# Altium schematic sheet ПЛАКАТ_A2.SchDoc: Наименование
size 594 x 420 mm; ApprovedBy: Утвердил; CheckedBy: Проверил; Author: Разработал; CompanyName: Организация; SheetNumber: 1; SheetTotal: 1; PageSetup: Record=PageOptions|CenterHorizontal=True|CenterVertical=True|PrintScale=0.98|XCorrection=1.00|YCorrection=1.00|PrintKind=1|BorderSize=5000000|LeftOffset=0|BottomOffset=0|Orientation=2|PaperLength=1000|PaperWidth=1000|Scale=100|PaperSource=7|PrintQuality=-3|MediaType=1|DitherType=10|PrintScaleMode=1|PaperKind=A2|PaperIndex=66; DecimalNumber: Децимальный номер; HeadOfSector: Нач. сектора; MainDevice: Перв.примен.; Name1: Наименование1; lit_A: О; n_kontr: Н. Контр; t_kontr: Т. Контр; Name2: Наименование2; DocumentName: Sheet1.SCHDOC
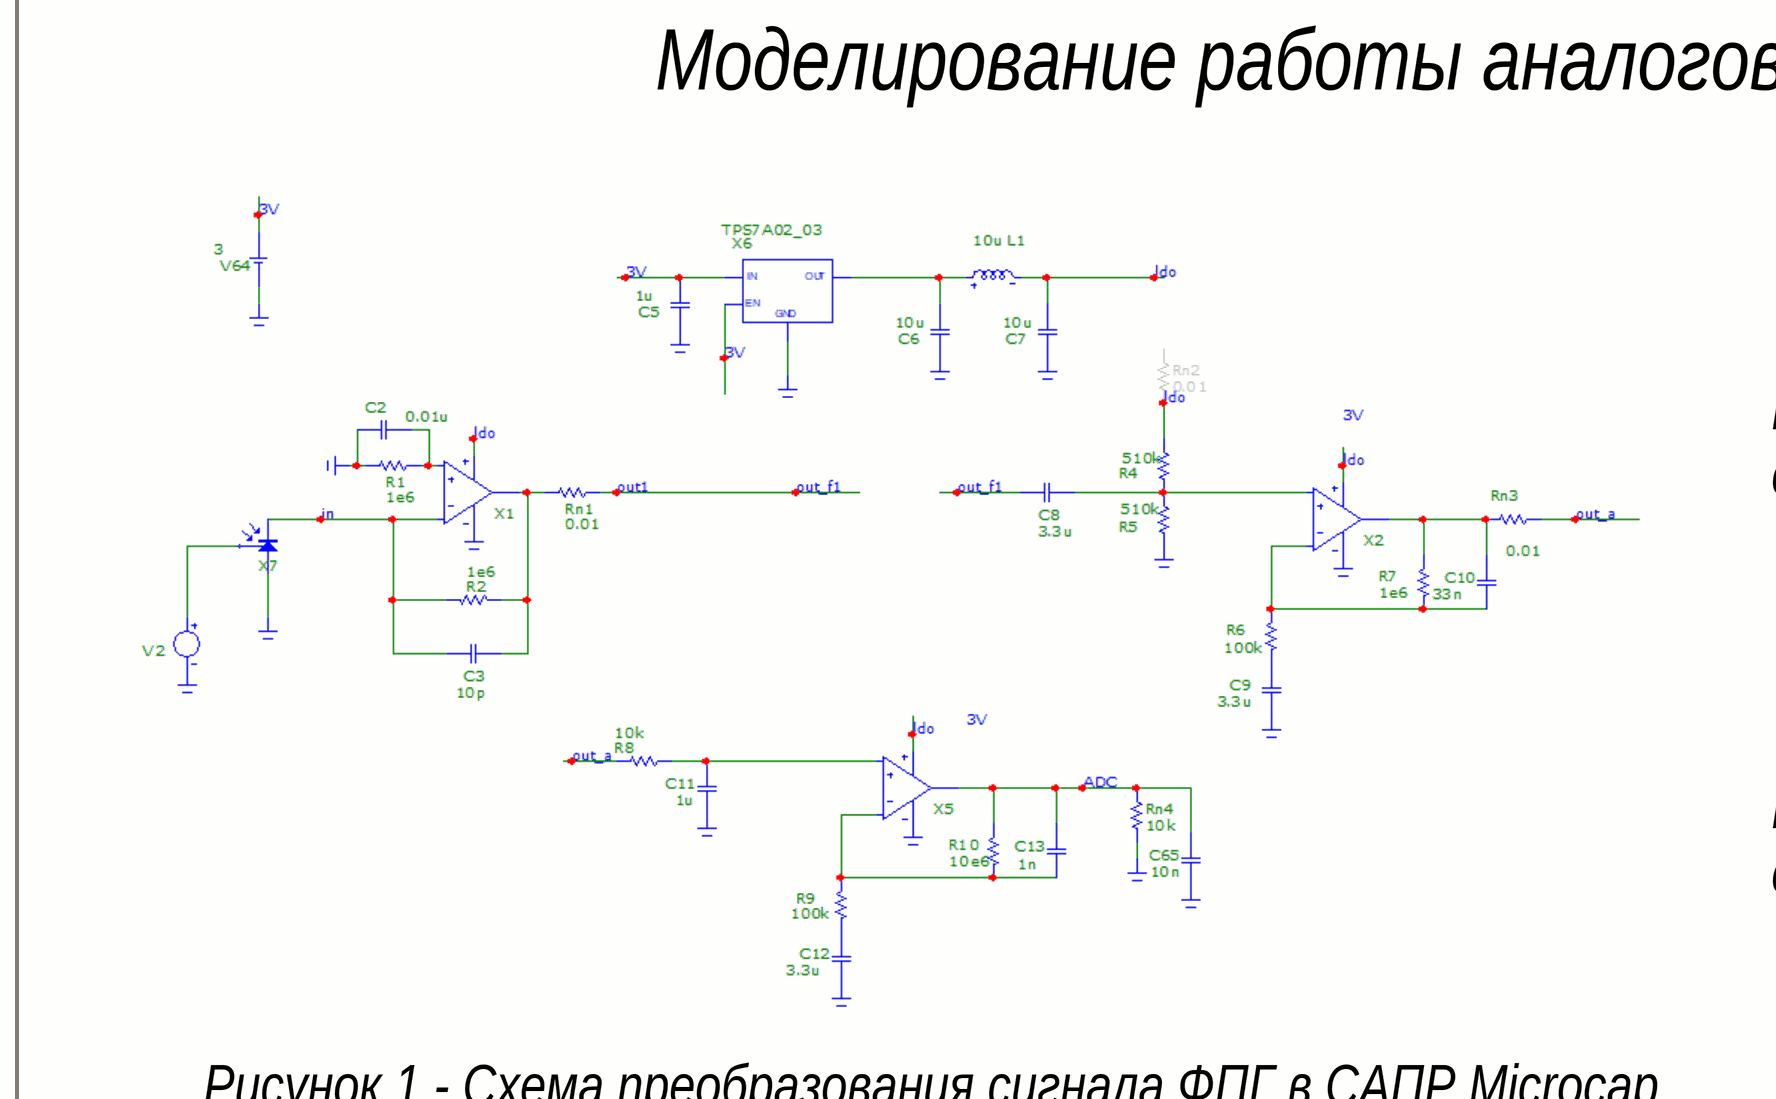
[diagram p0: ПЛАКАТ_A2.SchDoc, top left]
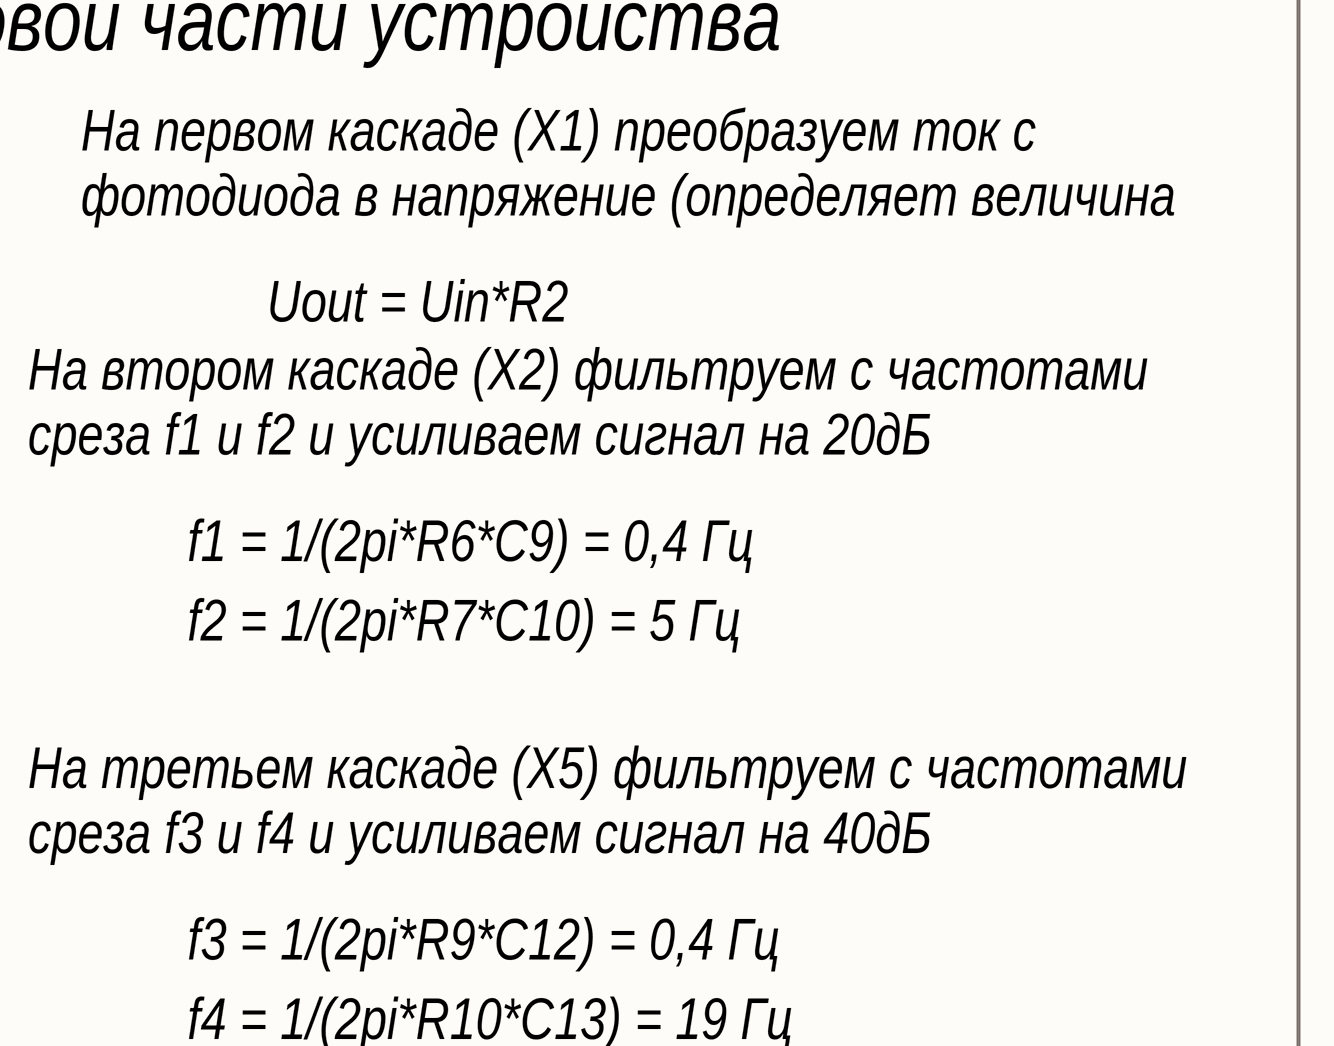
[diagram p1: ПЛАКАТ_A2.SchDoc, top right]
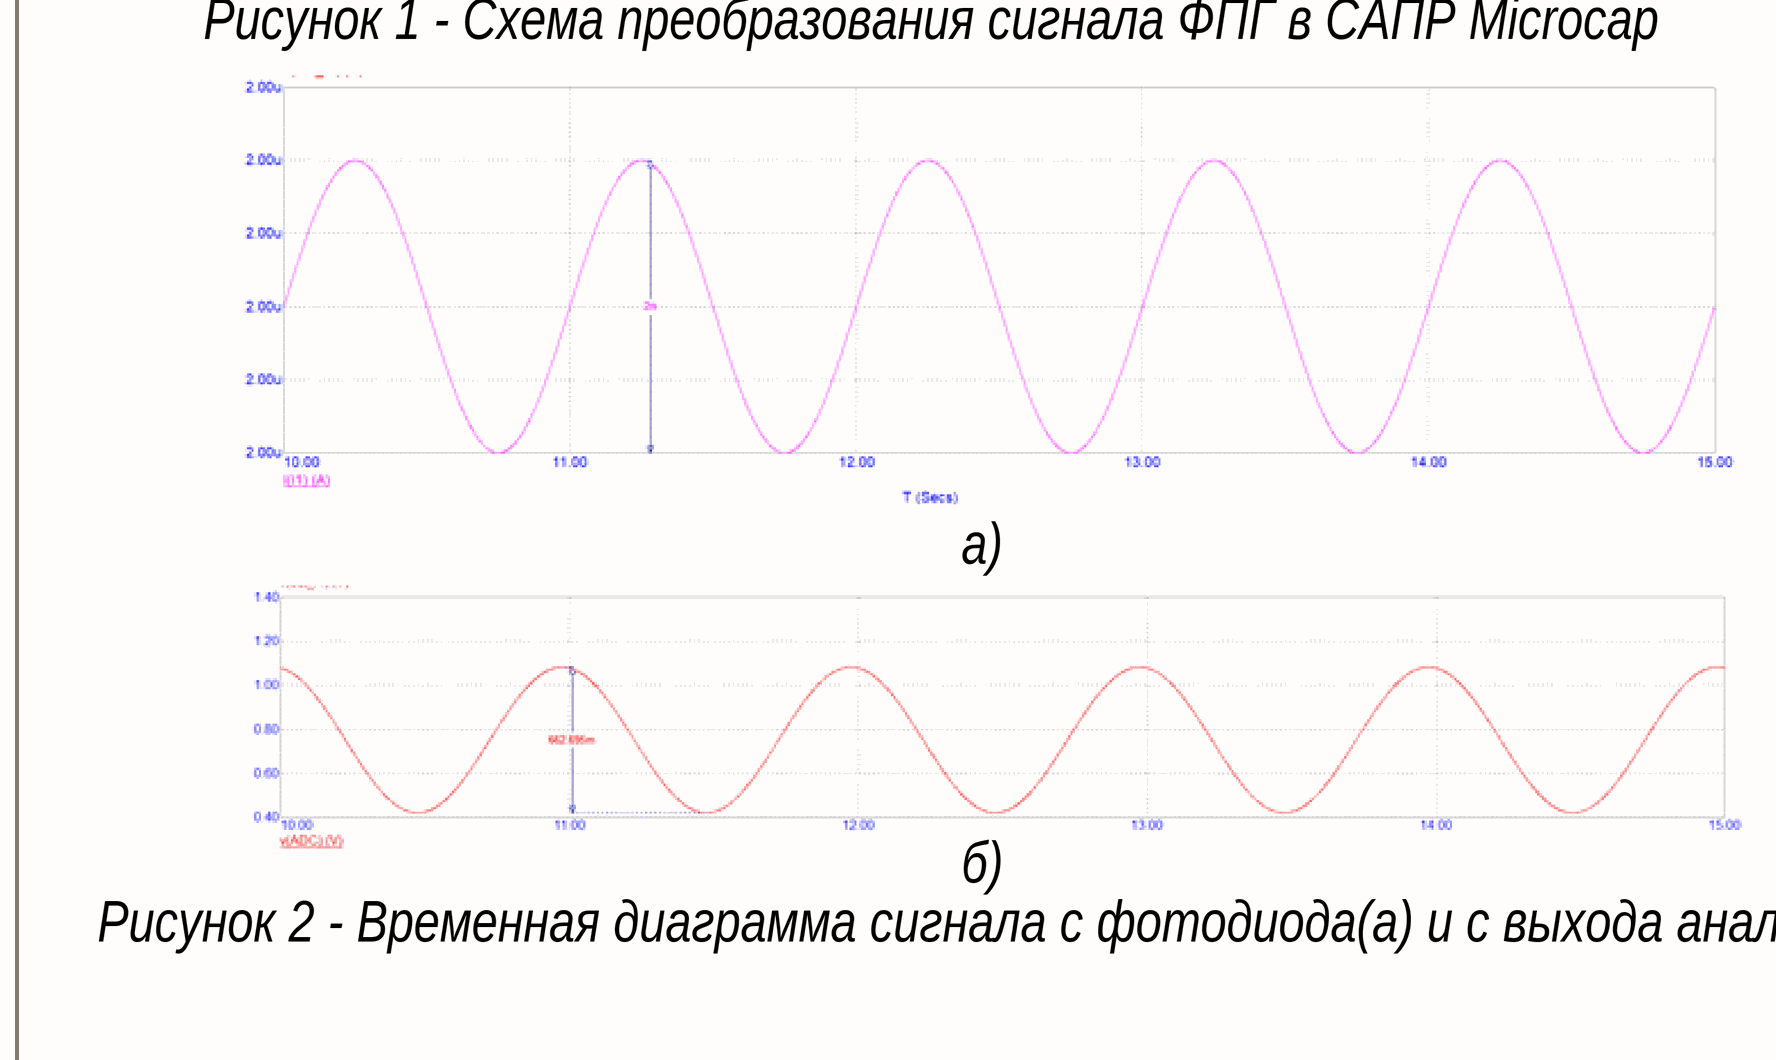
[diagram p2: ПЛАКАТ_A2.SchDoc, bottom left]
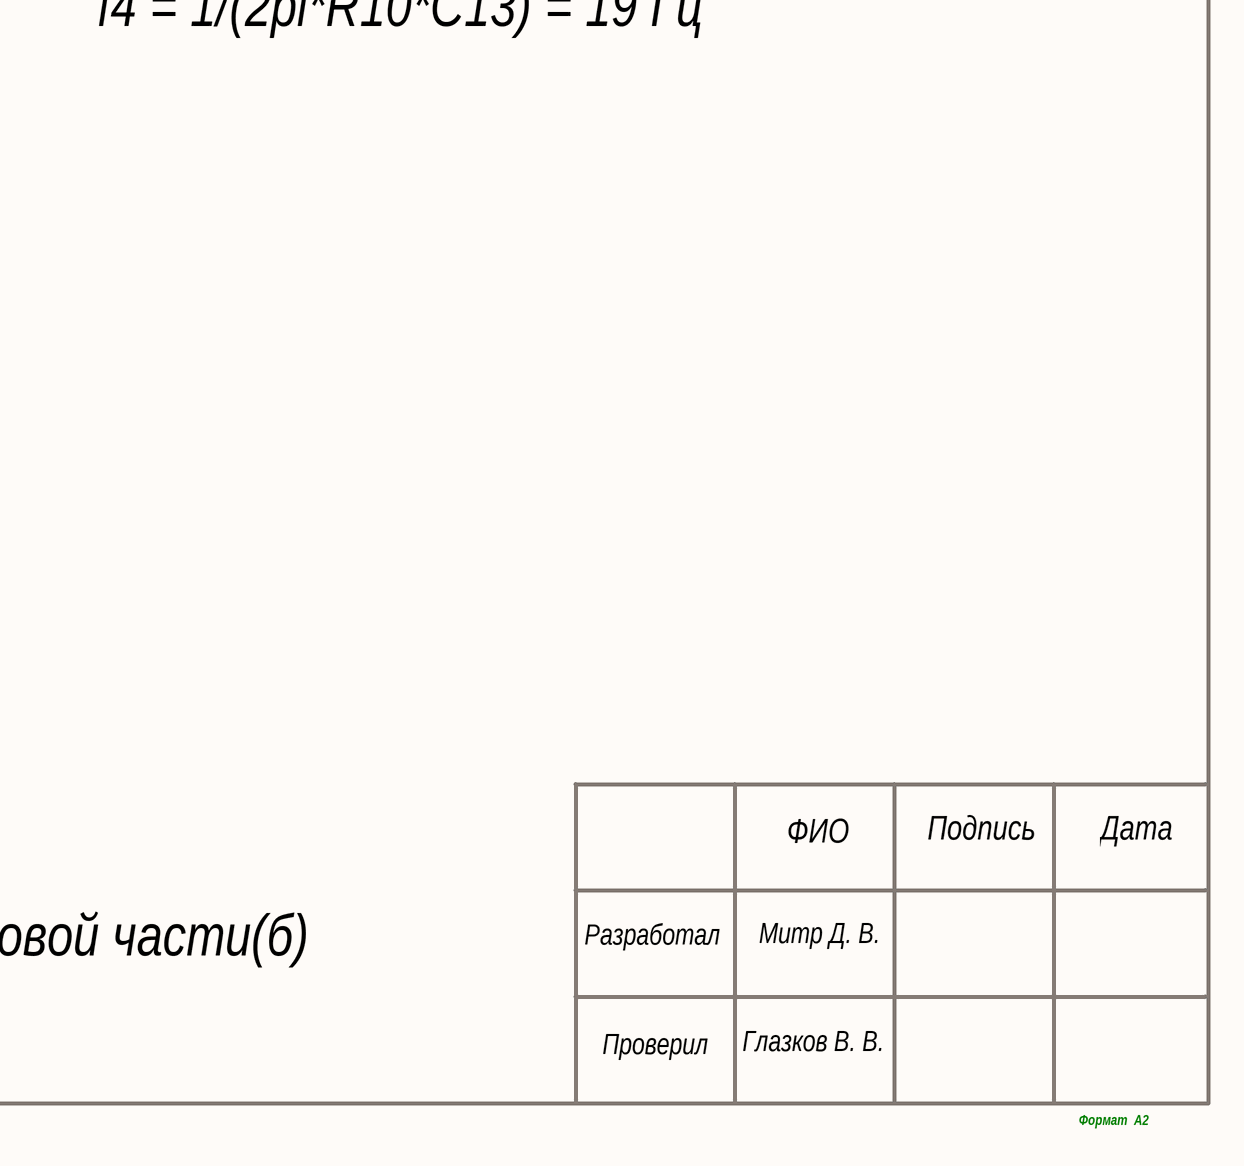
[diagram p3: ПЛАКАТ_A2.SchDoc, bottom right]

## Notes on the sheet
- Моделирование работы аналоговой части устройства
- На первом каскаде (X1) преобразуем ток с фотодиода в напряжение (определяет величина R2)
- Uout = Uin*R2
- На втором каскаде (X2) фильтруем с частотами среза f1 и f2 и усиливаем сигнал на 20дБ
- f1 = 1/(2pi*R6*C9) = 0,4 Гц
- f2 = 1/(2pi*R7*C10) = 5 Гц
- На третьем каскаде (X5) фильтруем с частотами среза f3 и f4 и усиливаем сигнал на 40дБ
- f3 = 1/(2pi*R9*C12) = 0,4 Гц
- Рисунок 1 - Схема преобразования сигнала ФПГ в САПР Microcap
- f4 = 1/(2pi*R10*C13) = 19 Гц
- а)
- ФИО
- Подпись
- Дата
- б)
- Разработал
- Митр Д. В.
- Рисунок 2 - Временная диаграмма сигнала с фотодиода(а) и с выхода аналоговой части(б)
- Проверил
- Глазков В. В.
- Формат  A2